# Altium schematic sheet 0243_GPU DECOUPLING_ VD.SchDoc
size 848 x 558 mm
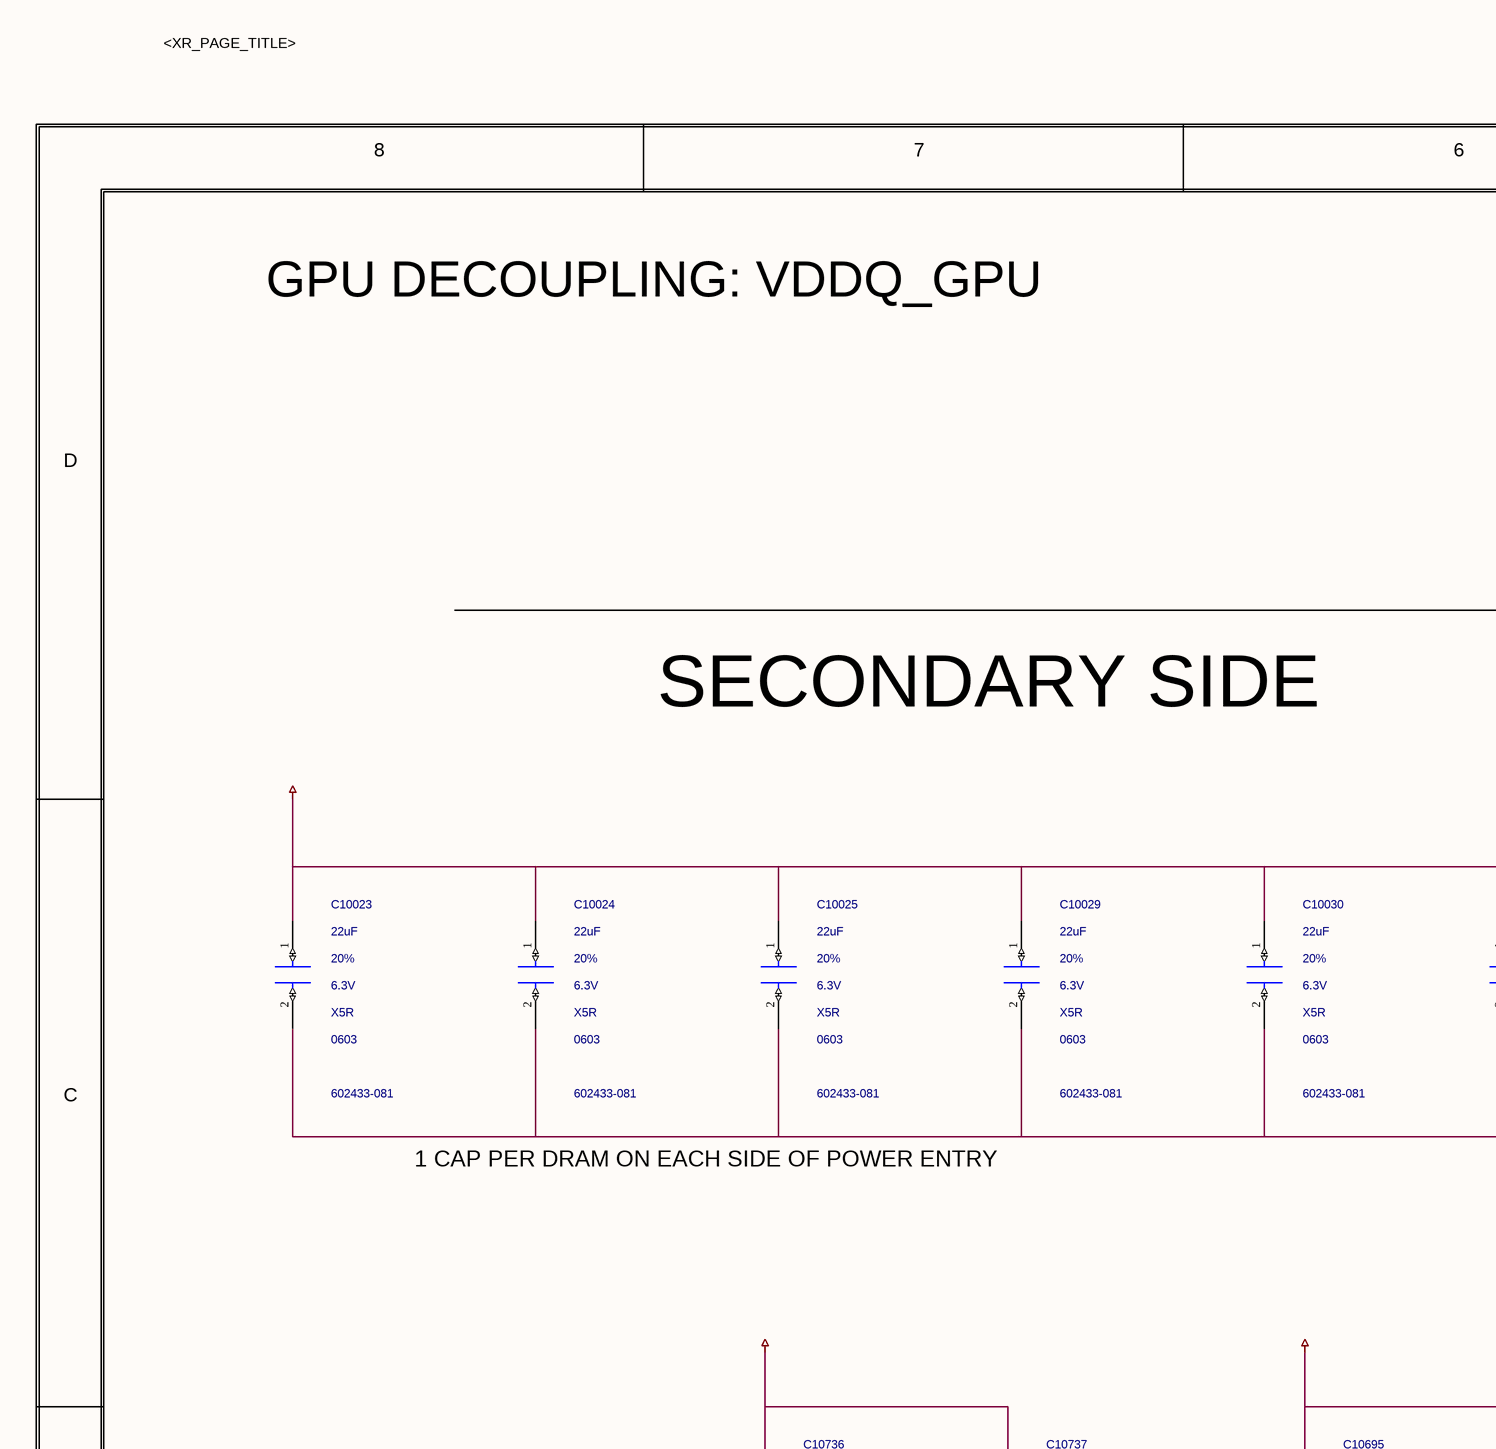
[diagram p0: 0243_GPU DECOUPLING_ VD.SchDoc, top left]
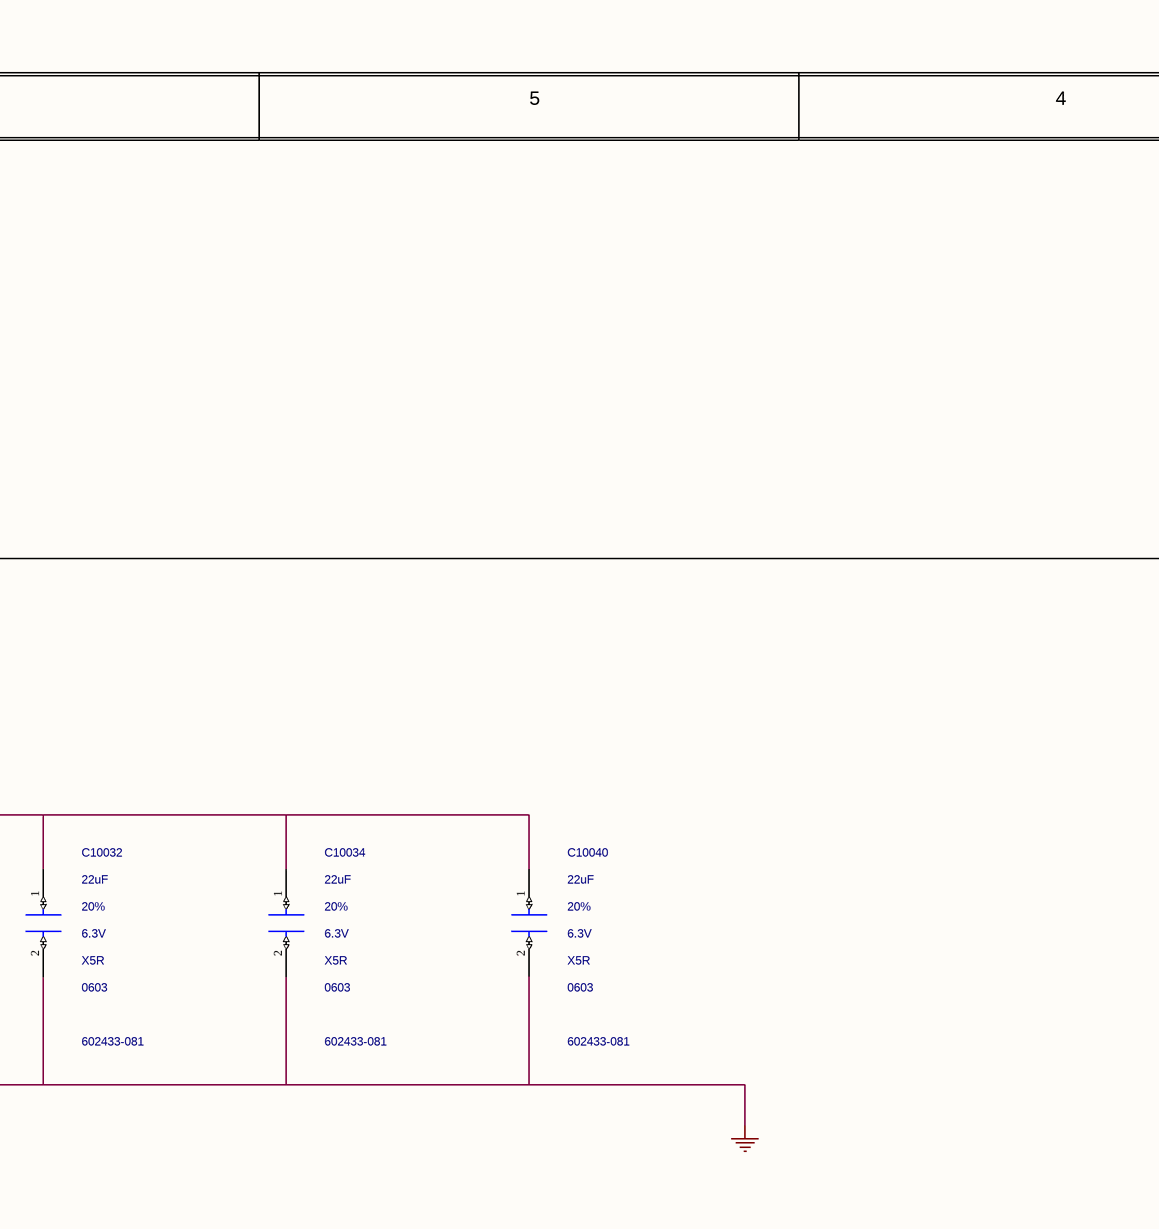
[diagram p1: 0243_GPU DECOUPLING_ VD.SchDoc, top middle]
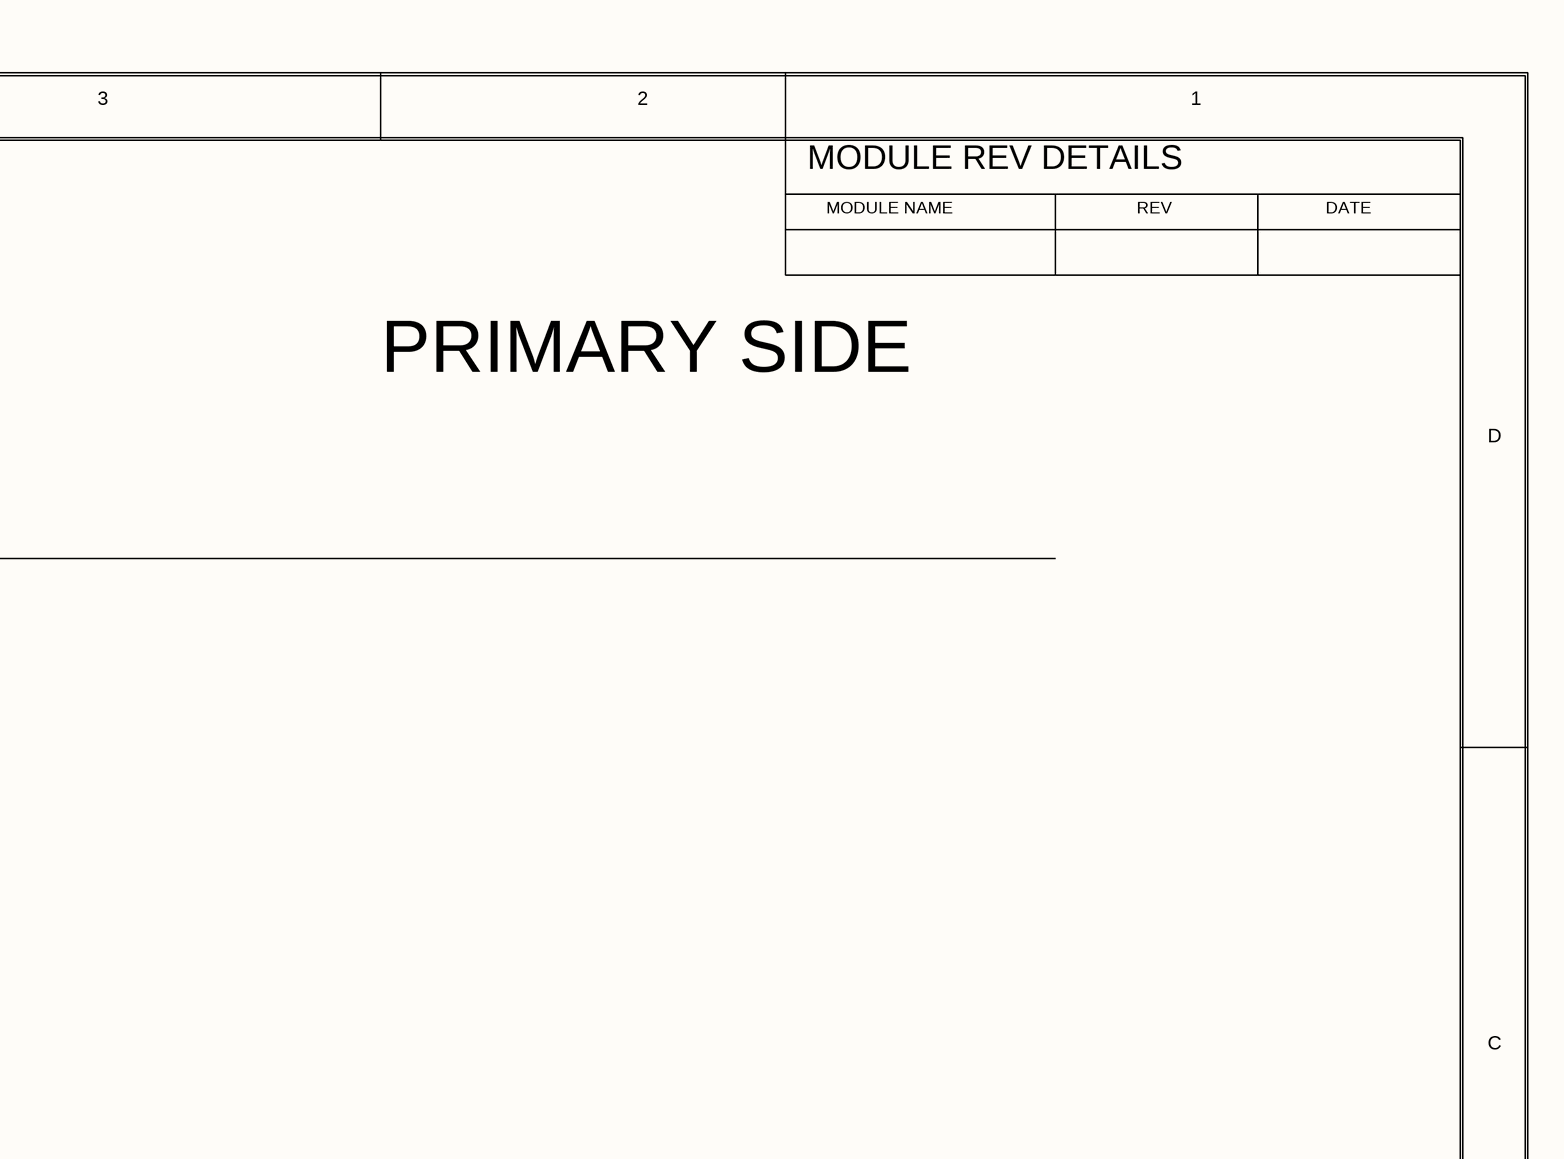
[diagram p2: 0243_GPU DECOUPLING_ VD.SchDoc, top right]
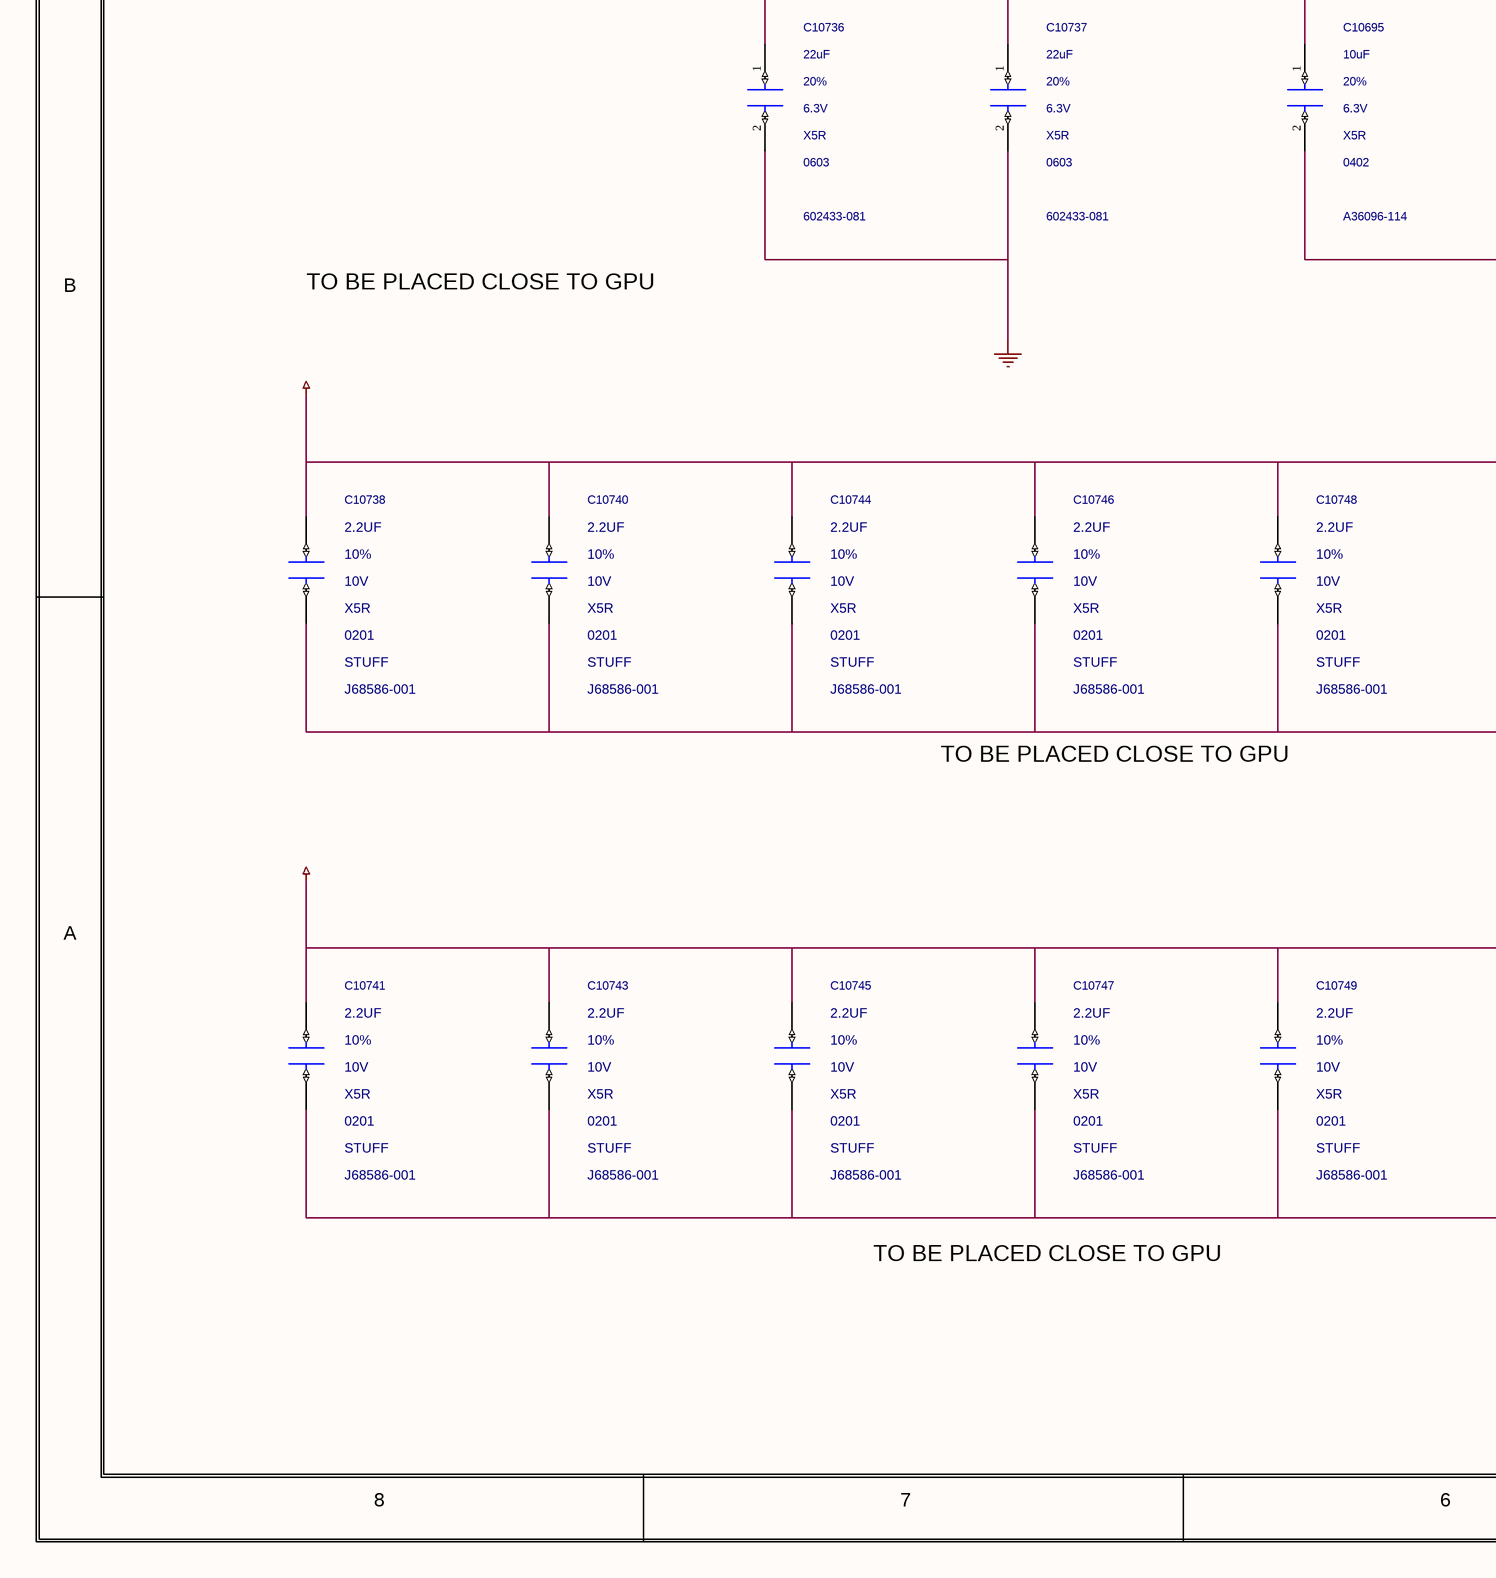
[diagram p3: 0243_GPU DECOUPLING_ VD.SchDoc, bottom left]
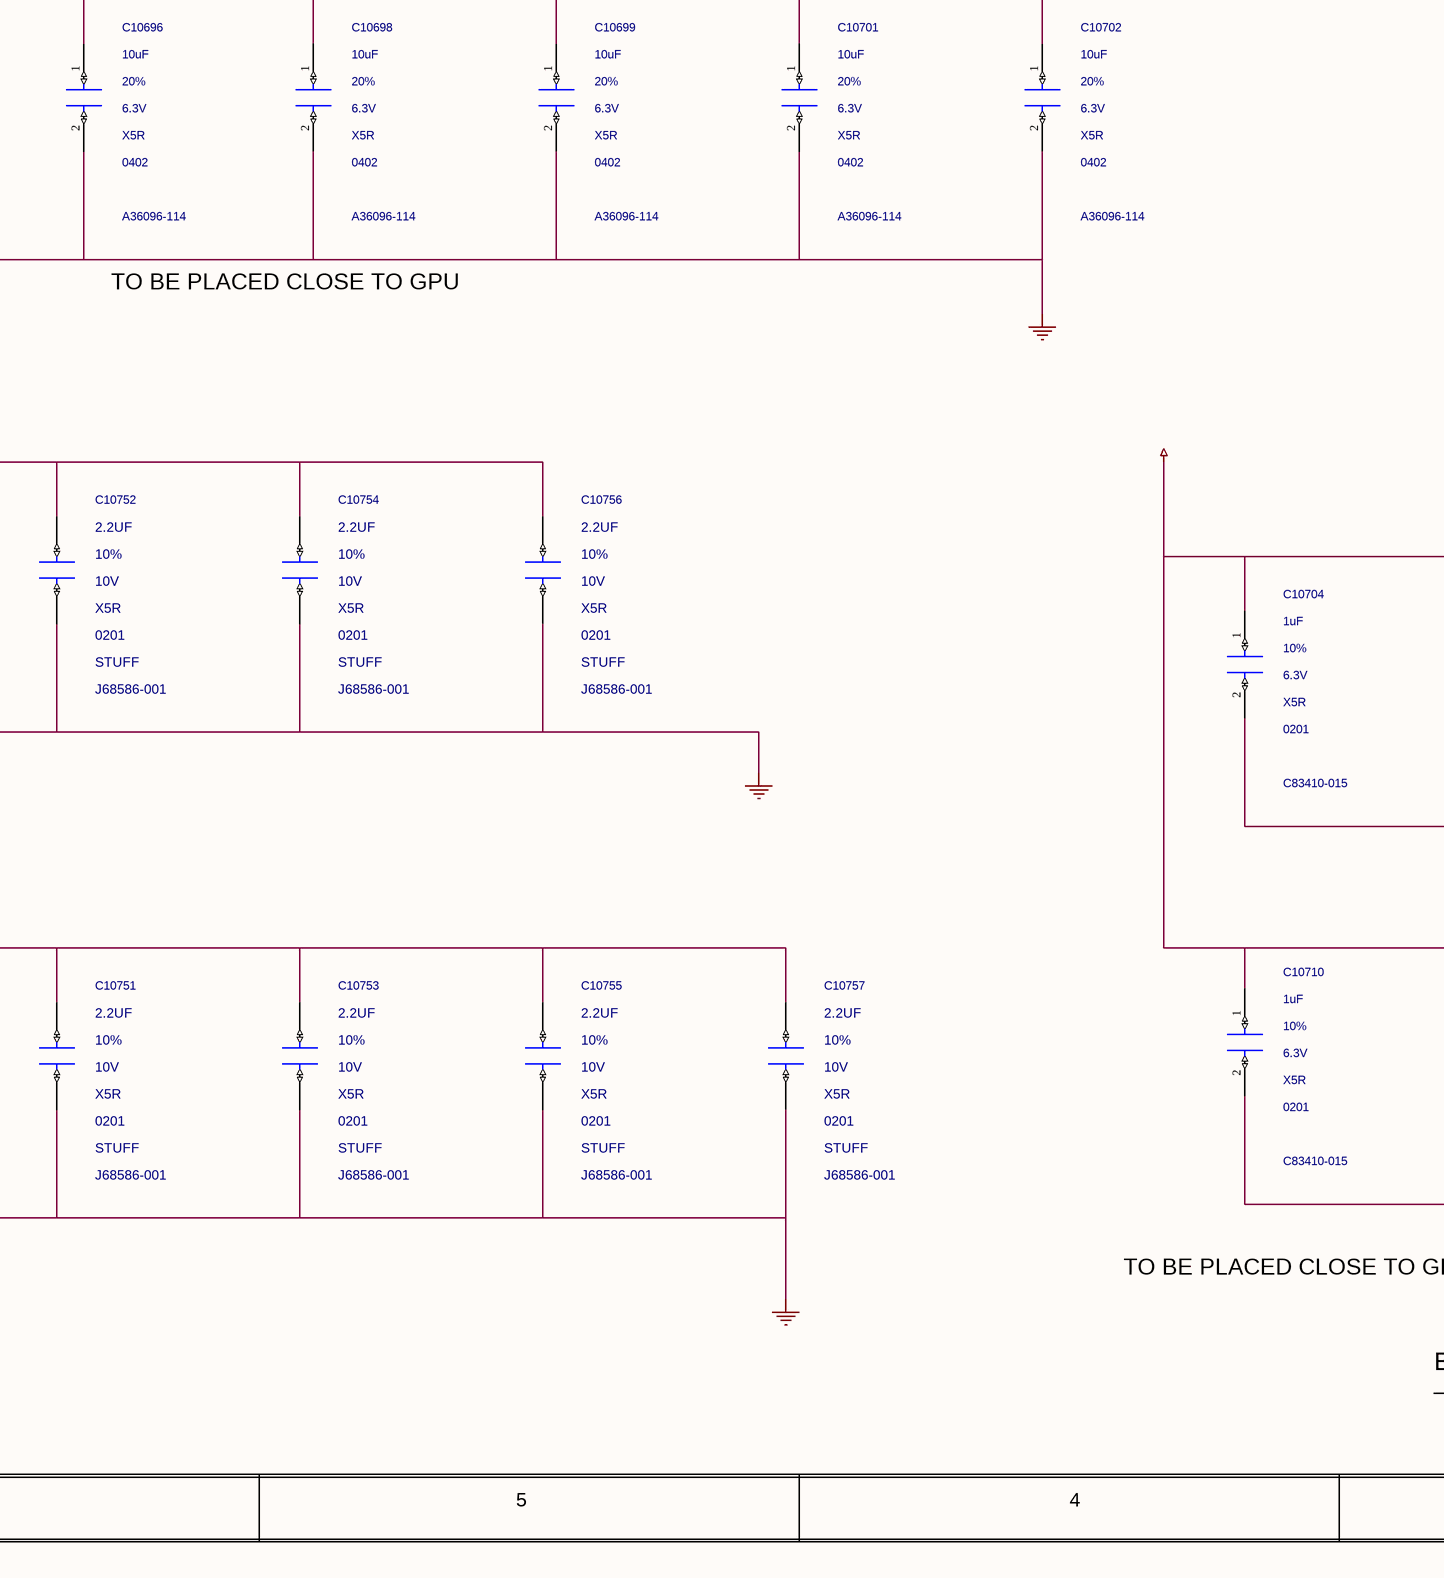
[diagram p4: 0243_GPU DECOUPLING_ VD.SchDoc, bottom middle]
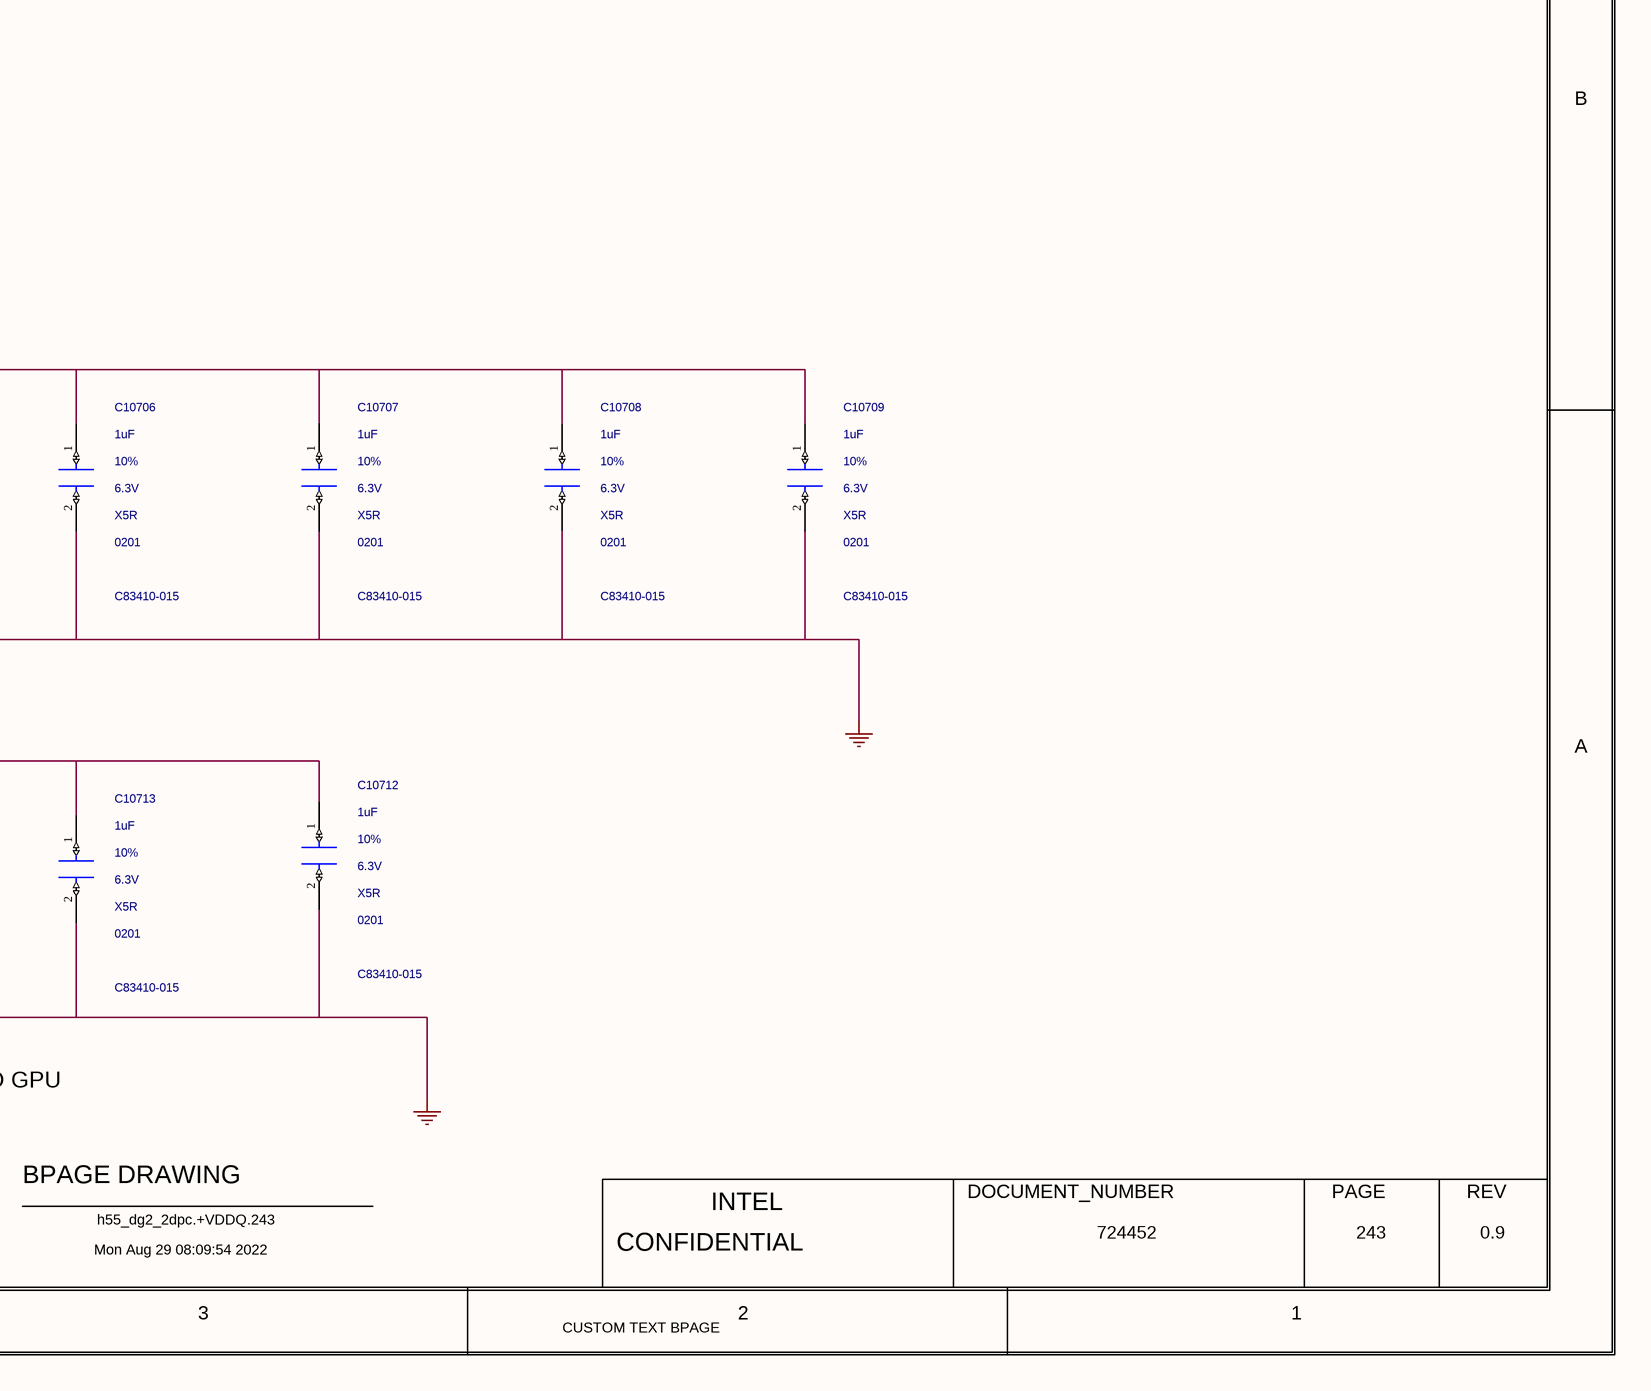
[diagram p5: 0243_GPU DECOUPLING_ VD.SchDoc, bottom right]

## Parts
C10023  22uF  MATERIAL: X5R  PACK_TYPE: 0603  PART_NUMBER: 602433-081  TOLERANCE: 20%  VOLTAGE: 6.3V  [SMC0603ID]
C10024  22uF  MATERIAL: X5R  PACK_TYPE: 0603  PART_NUMBER: 602433-081  TOLERANCE: 20%  VOLTAGE: 6.3V  [SMC0603ID]
C10025  22uF  MATERIAL: X5R  PACK_TYPE: 0603  PART_NUMBER: 602433-081  TOLERANCE: 20%  VOLTAGE: 6.3V  [SMC0603ID]
C10029  22uF  MATERIAL: X5R  PACK_TYPE: 0603  PART_NUMBER: 602433-081  TOLERANCE: 20%  VOLTAGE: 6.3V  [SMC0603ID]
C10030  22uF  MATERIAL: X5R  PACK_TYPE: 0603  PART_NUMBER: 602433-081  TOLERANCE: 20%  VOLTAGE: 6.3V  [SMC0603ID]
C10032  22uF  MATERIAL: X5R  PACK_TYPE: 0603  PART_NUMBER: 602433-081  TOLERANCE: 20%  VOLTAGE: 6.3V  [SMC0603ID]
C10034  22uF  MATERIAL: X5R  PACK_TYPE: 0603  PART_NUMBER: 602433-081  TOLERANCE: 20%  VOLTAGE: 6.3V  [SMC0603ID]
C10040  22uF  MATERIAL: X5R  PACK_TYPE: 0603  PART_NUMBER: 602433-081  TOLERANCE: 20%  VOLTAGE: 6.3V  [SMC0603ID]
C10695  10uF  MATERIAL: X5R  PACK_TYPE: 0402  PART_NUMBER: A36096-114  TOLERANCE: 20%  VOLTAGE: 6.3V  [SMC0402IA]
C10696  10uF  MATERIAL: X5R  PACK_TYPE: 0402  PART_NUMBER: A36096-114  TOLERANCE: 20%  VOLTAGE: 6.3V  [SMC0402IA]
C10698  10uF  MATERIAL: X5R  PACK_TYPE: 0402  PART_NUMBER: A36096-114  TOLERANCE: 20%  VOLTAGE: 6.3V  [SMC0402IA]
C10699  10uF  MATERIAL: X5R  PACK_TYPE: 0402  PART_NUMBER: A36096-114  TOLERANCE: 20%  VOLTAGE: 6.3V  [SMC0402IA]
C10701  10uF  MATERIAL: X5R  PACK_TYPE: 0402  PART_NUMBER: A36096-114  TOLERANCE: 20%  VOLTAGE: 6.3V  [SMC0402IA]
C10702  10uF  MATERIAL: X5R  PACK_TYPE: 0402  PART_NUMBER: A36096-114  TOLERANCE: 20%  VOLTAGE: 6.3V  [SMC0402IA]
C10704  1uF  MATERIAL: X5R  PACK_TYPE: 0201  PART_NUMBER: C83410-015  TOLERANCE: 10%  VOLTAGE: 6.3V  [SMC0201IA]
C10706  1uF  MATERIAL: X5R  PACK_TYPE: 0201  PART_NUMBER: C83410-015  TOLERANCE: 10%  VOLTAGE: 6.3V  [SMC0201IA]
C10707  1uF  MATERIAL: X5R  PACK_TYPE: 0201  PART_NUMBER: C83410-015  TOLERANCE: 10%  VOLTAGE: 6.3V  [SMC0201IA]
C10708  1uF  MATERIAL: X5R  PACK_TYPE: 0201  PART_NUMBER: C83410-015  TOLERANCE: 10%  VOLTAGE: 6.3V  [SMC0201IA]
C10709  1uF  MATERIAL: X5R  PACK_TYPE: 0201  PART_NUMBER: C83410-015  TOLERANCE: 10%  VOLTAGE: 6.3V  [SMC0201IA]
C10710  1uF  MATERIAL: X5R  PACK_TYPE: 0201  PART_NUMBER: C83410-015  TOLERANCE: 10%  VOLTAGE: 6.3V  [SMC0201IA]
C10712  1uF  MATERIAL: X5R  PACK_TYPE: 0201  PART_NUMBER: C83410-015  TOLERANCE: 10%  VOLTAGE: 6.3V  [SMC0201IA]
C10713  1uF  MATERIAL: X5R  PACK_TYPE: 0201  PART_NUMBER: C83410-015  TOLERANCE: 10%  VOLTAGE: 6.3V  [SMC0201IA]
C10736  22uF  MATERIAL: X5R  PACK_TYPE: 0603  PART_NUMBER: 602433-081  TOLERANCE: 20%  VOLTAGE: 6.3V  [SMC0603ID]
C10737  22uF  MATERIAL: X5R  PACK_TYPE: 0603  PART_NUMBER: 602433-081  TOLERANCE: 20%  VOLTAGE: 6.3V  [SMC0603ID]
C10738  2.2UF  BOM_USE: STUFF  MATERIAL: X5R  PACK_TYPE: 0201  PART_NUMBER: J68586-001  TOLERANCE: 10%  VOLTAGE: 10V  [TK0_SM0201_690X390_MC]
C10740  2.2UF  BOM_USE: STUFF  MATERIAL: X5R  PACK_TYPE: 0201  PART_NUMBER: J68586-001  TOLERANCE: 10%  VOLTAGE: 10V  [TK0_SM0201_690X390_MC]
C10741  2.2UF  BOM_USE: STUFF  MATERIAL: X5R  PACK_TYPE: 0201  PART_NUMBER: J68586-001  TOLERANCE: 10%  VOLTAGE: 10V  [TK0_SM0201_690X390_MC]
C10743  2.2UF  BOM_USE: STUFF  MATERIAL: X5R  PACK_TYPE: 0201  PART_NUMBER: J68586-001  TOLERANCE: 10%  VOLTAGE: 10V  [TK0_SM0201_690X390_MC]
C10744  2.2UF  BOM_USE: STUFF  MATERIAL: X5R  PACK_TYPE: 0201  PART_NUMBER: J68586-001  TOLERANCE: 10%  VOLTAGE: 10V  [TK0_SM0201_690X390_MC]
C10745  2.2UF  BOM_USE: STUFF  MATERIAL: X5R  PACK_TYPE: 0201  PART_NUMBER: J68586-001  TOLERANCE: 10%  VOLTAGE: 10V  [TK0_SM0201_690X390_MC]
C10746  2.2UF  BOM_USE: STUFF  MATERIAL: X5R  PACK_TYPE: 0201  PART_NUMBER: J68586-001  TOLERANCE: 10%  VOLTAGE: 10V  [TK0_SM0201_690X390_MC]
C10747  2.2UF  BOM_USE: STUFF  MATERIAL: X5R  PACK_TYPE: 0201  PART_NUMBER: J68586-001  TOLERANCE: 10%  VOLTAGE: 10V  [TK0_SM0201_690X390_MC]
C10748  2.2UF  BOM_USE: STUFF  MATERIAL: X5R  PACK_TYPE: 0201  PART_NUMBER: J68586-001  TOLERANCE: 10%  VOLTAGE: 10V  [TK0_SM0201_690X390_MC]
C10749  2.2UF  BOM_USE: STUFF  MATERIAL: X5R  PACK_TYPE: 0201  PART_NUMBER: J68586-001  TOLERANCE: 10%  VOLTAGE: 10V  [TK0_SM0201_690X390_MC]
C10751  2.2UF  BOM_USE: STUFF  MATERIAL: X5R  PACK_TYPE: 0201  PART_NUMBER: J68586-001  TOLERANCE: 10%  VOLTAGE: 10V  [TK0_SM0201_690X390_MC]
C10752  2.2UF  BOM_USE: STUFF  MATERIAL: X5R  PACK_TYPE: 0201  PART_NUMBER: J68586-001  TOLERANCE: 10%  VOLTAGE: 10V  [TK0_SM0201_690X390_MC]
C10753  2.2UF  BOM_USE: STUFF  MATERIAL: X5R  PACK_TYPE: 0201  PART_NUMBER: J68586-001  TOLERANCE: 10%  VOLTAGE: 10V  [TK0_SM0201_690X390_MC]
C10754  2.2UF  BOM_USE: STUFF  MATERIAL: X5R  PACK_TYPE: 0201  PART_NUMBER: J68586-001  TOLERANCE: 10%  VOLTAGE: 10V  [TK0_SM0201_690X390_MC]
C10755  2.2UF  BOM_USE: STUFF  MATERIAL: X5R  PACK_TYPE: 0201  PART_NUMBER: J68586-001  TOLERANCE: 10%  VOLTAGE: 10V  [TK0_SM0201_690X390_MC]
C10756  2.2UF  BOM_USE: STUFF  MATERIAL: X5R  PACK_TYPE: 0201  PART_NUMBER: J68586-001  TOLERANCE: 10%  VOLTAGE: 10V  [TK0_SM0201_690X390_MC]
C10757  2.2UF  BOM_USE: STUFF  MATERIAL: X5R  PACK_TYPE: 0201  PART_NUMBER: J68586-001  TOLERANCE: 10%  VOLTAGE: 10V  [TK0_SM0201_690X390_MC]

## Nets
+VDDQ_GPU: C10023.1(A) C10024.1(A) C10025.1(A) C10029.1(A) C10030.1(A) C10032.1(A) C10034.1(A) C10040.1(A) C10695.1(A) C10696.1(A) C10698.1(A) C10699.1(A) C10701.1(A) C10702.1(A) C10704.1(A) C10706.1(A) C10707.1(A) C10708.1(A) C10709.1(A) C10710.1(A) C10712.1(A) C10713.1(A) C10736.1(A) C10737.1(A) C10738.1(A) C10740.1(A) C10741.1(A) C10743.1(A) C10744.1(A) C10745.1(A) C10746.1(A) C10747.1(A) C10748.1(A) C10749.1(A) C10751.1(A) C10752.1(A) C10753.1(A) C10754.1(A) C10755.1(A) C10756.1(A) C10757.1(A)
GND: C10023.2(B) C10024.2(B) C10025.2(B) C10029.2(B) C10030.2(B) C10032.2(B) C10034.2(B) C10040.2(B) C10695.2(B) C10696.2(B) C10698.2(B) C10699.2(B) C10701.2(B) C10702.2(B) C10704.2(B) C10706.2(B) C10707.2(B) C10708.2(B) C10709.2(B) C10710.2(B) C10712.2(B) C10713.2(B) C10736.2(B) C10737.2(B) C10738.2(B) C10740.2(B) C10741.2(B) C10743.2(B) C10744.2(B) C10745.2(B) C10746.2(B) C10747.2(B) C10748.2(B) C10749.2(B) C10751.2(B) C10752.2(B) C10753.2(B) C10754.2(B) C10755.2(B) C10756.2(B) C10757.2(B)

## Notes on the sheet
- <XR_PAGE_TITLE>
- 8
- 7
- 6
- 5
- 4
- 3
- 2
- 1
- MODULE REV DETAILS
- GPU DECOUPLING: VDDQ_GPU
- MODULE NAME
- REV
- DATE
- PRIMARY SIDE
- D
- SECONDARY SIDE
- C
- 1 CAP PER DRAM ON EACH SIDE OF POWER ENTRY
- B
- TO BE PLACED CLOSE TO GPU
- A
- BPAGE DRAWING
- INTEL
- DOCUMENT_NUMBER
- PAGE
- Mon Aug 29 08:09:54 2022
- h55_dg2_2dpc.+VDDQ.243
- CONFIDENTIAL
- 724452
- 243
- 0.9
- CUSTOM TEXT BPAGE

## Library data of the parts
C10023 = CAP: CDS_PHYS_PART_NAME: CAP_0603-602433-081,X5R,22UF,6.3V,20%,LPDB,GENERIC; OriginalSymbolOrigin: (-50,25); XY: (-2425,2475); VER: 1; ROT: 0; PHYS_PAGE: 243; LOCATION: C10023; DRAWING: @RVP1_ADL_SB_ADP_S_DDR5_SODIMM_2DPC_LIB.H55_DG2_2DPC(SCH_1):PAGE414; CDS_LIB: discrete; PCB Footprint: SMC0603ID; CHIPS_PART_NAME: CAP; CDS_PART_NAME: CAP_0603-602433-081,X5R,22UF,6.3V,20%,LPDB,GENERIC; CDS_LOCATION: C10023
C10024 = CAP: CDS_PHYS_PART_NAME: CAP_0603-602433-081,X5R,22UF,6.3V,20%,LPDB,GENERIC; OriginalSymbolOrigin: (-50,25); XY: (-1975,2475); VER: 1; ROT: 0; PHYS_PAGE: 243; LOCATION: C10024; DRAWING: @RVP1_ADL_SB_ADP_S_DDR5_SODIMM_2DPC_LIB.H55_DG2_2DPC(SCH_1):PAGE414; CDS_LIB: discrete; PCB Footprint: SMC0603ID; CHIPS_PART_NAME: CAP; CDS_PART_NAME: CAP_0603-602433-081,X5R,22UF,6.3V,20%,LPDB,GENERIC; CDS_LOCATION: C10024
C10025 = CAP: CDS_PHYS_PART_NAME: CAP_0603-602433-081,X5R,22UF,6.3V,20%,LPDB,GENERIC; OriginalSymbolOrigin: (-50,25); XY: (-1525,2475); VER: 1; ROT: 0; PHYS_PAGE: 243; LOCATION: C10025; DRAWING: @RVP1_ADL_SB_ADP_S_DDR5_SODIMM_2DPC_LIB.H55_DG2_2DPC(SCH_1):PAGE414; CDS_LIB: discrete; PCB Footprint: SMC0603ID; CHIPS_PART_NAME: CAP; CDS_PART_NAME: CAP_0603-602433-081,X5R,22UF,6.3V,20%,LPDB,GENERIC; CDS_LOCATION: C10025
C10029 = CAP: CDS_PHYS_PART_NAME: CAP_0603-602433-081,X5R,22UF,6.3V,20%,LPDB,GENERIC; OriginalSymbolOrigin: (-50,25); XY: (-1075,2475); VER: 1; ROT: 0; PHYS_PAGE: 243; LOCATION: C10029; DRAWING: @RVP1_ADL_SB_ADP_S_DDR5_SODIMM_2DPC_LIB.H55_DG2_2DPC(SCH_1):PAGE414; CDS_LIB: discrete; PCB Footprint: SMC0603ID; CHIPS_PART_NAME: CAP; CDS_PART_NAME: CAP_0603-602433-081,X5R,22UF,6.3V,20%,LPDB,GENERIC; CDS_LOCATION: C10029
C10030 = CAP: CDS_PHYS_PART_NAME: CAP_0603-602433-081,X5R,22UF,6.3V,20%,LPDB,GENERIC; OriginalSymbolOrigin: (-50,25); XY: (-625,2475); VER: 1; ROT: 0; PHYS_PAGE: 243; LOCATION: C10030; DRAWING: @RVP1_ADL_SB_ADP_S_DDR5_SODIMM_2DPC_LIB.H55_DG2_2DPC(SCH_1):PAGE414; CDS_LIB: discrete; PCB Footprint: SMC0603ID; CHIPS_PART_NAME: CAP; CDS_PART_NAME: CAP_0603-602433-081,X5R,22UF,6.3V,20%,LPDB,GENERIC; CDS_LOCATION: C10030
C10032 = CAP: CDS_PHYS_PART_NAME: CAP_0603-602433-081,X5R,22UF,6.3V,20%,LPDB,GENERIC; OriginalSymbolOrigin: (-50,25); XY: (-175,2475); VER: 1; ROT: 0; PHYS_PAGE: 243; LOCATION: C10032; DRAWING: @RVP1_ADL_SB_ADP_S_DDR5_SODIMM_2DPC_LIB.H55_DG2_2DPC(SCH_1):PAGE414; CDS_LIB: discrete; PCB Footprint: SMC0603ID; CHIPS_PART_NAME: CAP; CDS_PART_NAME: CAP_0603-602433-081,X5R,22UF,6.3V,20%,LPDB,GENERIC; CDS_LOCATION: C10032
C10034 = CAP: CDS_PHYS_PART_NAME: CAP_0603-602433-081,X5R,22UF,6.3V,20%,LPDB,GENERIC; OriginalSymbolOrigin: (-50,25); XY: (275,2475); VER: 1; ROT: 0; PHYS_PAGE: 243; LOCATION: C10034; DRAWING: @RVP1_ADL_SB_ADP_S_DDR5_SODIMM_2DPC_LIB.H55_DG2_2DPC(SCH_1):PAGE414; CDS_LIB: discrete; PCB Footprint: SMC0603ID; CHIPS_PART_NAME: CAP; CDS_PART_NAME: CAP_0603-602433-081,X5R,22UF,6.3V,20%,LPDB,GENERIC; CDS_LOCATION: C10034
C10040 = CAP: CDS_PHYS_PART_NAME: CAP_0603-602433-081,X5R,22UF,6.3V,20%,LPDB,GENERIC; OriginalSymbolOrigin: (-50,25); XY: (725,2475); VER: 1; ROT: 0; PHYS_PAGE: 243; LOCATION: C10040; DRAWING: @RVP1_ADL_SB_ADP_S_DDR5_SODIMM_2DPC_LIB.H55_DG2_2DPC(SCH_1):PAGE414; CDS_LIB: discrete; PCB Footprint: SMC0603ID; CHIPS_PART_NAME: CAP; CDS_PART_NAME: CAP_0603-602433-081,X5R,22UF,6.3V,20%,LPDB,GENERIC; CDS_LOCATION: C10040
C10695 = CAP: CDS_PHYS_PART_NAME: CAP_0402-A36096-114,X5R,10UF,6.3V,20%,LPDB,GENERIC; OriginalSymbolOrigin: (-50,25); XY: (-550,1475); VER: 1; ROT: 0; PHYS_PAGE: 243; LOCATION: C10695; DRAWING: @RVP1_ADL_SB_ADP_S_DDR5_SODIMM_2DPC_LIB.H55_DG2_2DPC(SCH_1):PAGE414; CDS_LIB: discrete; PCB Footprint: SMC0402IA; CHIPS_PART_NAME: CAP; CDS_PART_NAME: CAP_0402-A36096-114,X5R,10UF,6.3V,20%,LPDB,GENERIC; CDS_LOCATION: C10695
C10696 = CAP: CDS_PHYS_PART_NAME: CAP_0402-A36096-114,X5R,10UF,6.3V,20%,LPDB,GENERIC; OriginalSymbolOrigin: (-50,25); XY: (-100,1475); VER: 1; ROT: 0; PHYS_PAGE: 243; LOCATION: C10696; DRAWING: @RVP1_ADL_SB_ADP_S_DDR5_SODIMM_2DPC_LIB.H55_DG2_2DPC(SCH_1):PAGE414; CDS_LIB: discrete; PCB Footprint: SMC0402IA; CHIPS_PART_NAME: CAP; CDS_PART_NAME: CAP_0402-A36096-114,X5R,10UF,6.3V,20%,LPDB,GENERIC; CDS_LOCATION: C10696
C10698 = CAP: CDS_PHYS_PART_NAME: CAP_0402-A36096-114,X5R,10UF,6.3V,20%,LPDB,GENERIC; OriginalSymbolOrigin: (-50,25); XY: (325,1475); VER: 1; ROT: 0; PHYS_PAGE: 243; LOCATION: C10698; DRAWING: @RVP1_ADL_SB_ADP_S_DDR5_SODIMM_2DPC_LIB.H55_DG2_2DPC(SCH_1):PAGE414; CDS_LIB: discrete; PCB Footprint: SMC0402IA; CHIPS_PART_NAME: CAP; CDS_PART_NAME: CAP_0402-A36096-114,X5R,10UF,6.3V,20%,LPDB,GENERIC; CDS_LOCATION: C10698
C10699 = CAP: CDS_PHYS_PART_NAME: CAP_0402-A36096-114,X5R,10UF,6.3V,20%,LPDB,GENERIC; OriginalSymbolOrigin: (-50,25); XY: (775,1475); VER: 1; ROT: 0; PHYS_PAGE: 243; LOCATION: C10699; DRAWING: @RVP1_ADL_SB_ADP_S_DDR5_SODIMM_2DPC_LIB.H55_DG2_2DPC(SCH_1):PAGE414; CDS_LIB: discrete; PCB Footprint: SMC0402IA; CHIPS_PART_NAME: CAP; CDS_PART_NAME: CAP_0402-A36096-114,X5R,10UF,6.3V,20%,LPDB,GENERIC; CDS_LOCATION: C10699
C10701 = CAP: CDS_PHYS_PART_NAME: CAP_0402-A36096-114,X5R,10UF,6.3V,20%,LPDB,GENERIC; OriginalSymbolOrigin: (-50,25); XY: (1225,1475); VER: 1; ROT: 0; PHYS_PAGE: 243; LOCATION: C10701; DRAWING: @RVP1_ADL_SB_ADP_S_DDR5_SODIMM_2DPC_LIB.H55_DG2_2DPC(SCH_1):PAGE414; CDS_LIB: discrete; PCB Footprint: SMC0402IA; CHIPS_PART_NAME: CAP; CDS_PART_NAME: CAP_0402-A36096-114,X5R,10UF,6.3V,20%,LPDB,GENERIC; CDS_LOCATION: C10701
C10702 = CAP: CDS_PHYS_PART_NAME: CAP_0402-A36096-114,X5R,10UF,6.3V,20%,LPDB,GENERIC; OriginalSymbolOrigin: (-50,25); XY: (1675,1475); VER: 1; ROT: 0; PHYS_PAGE: 243; LOCATION: C10702; DRAWING: @RVP1_ADL_SB_ADP_S_DDR5_SODIMM_2DPC_LIB.H55_DG2_2DPC(SCH_1):PAGE414; CDS_LIB: discrete; PCB Footprint: SMC0402IA; CHIPS_PART_NAME: CAP; CDS_PART_NAME: CAP_0402-A36096-114,X5R,10UF,6.3V,20%,LPDB,GENERIC; CDS_LOCATION: C10702
C10704 = CAP: CDS_PHYS_PART_NAME: CAP_0201-C83410-015,X5R,1UF,6.3V,10%,LPDB,GENERIC; OriginalSymbolOrigin: (-50,25); XY: (2050,425); VER: 1; ROT: 0; PHYS_PAGE: 243; LOCATION: C10704; DRAWING: @RVP1_ADL_SB_ADP_S_DDR5_SODIMM_2DPC_LIB.H55_DG2_2DPC(SCH_1):PAGE414; CDS_LIB: discrete; PCB Footprint: SMC0201IA; CHIPS_PART_NAME: CAP; CDS_PART_NAME: CAP_0201-C83410-015,X5R,1UF,6.3V,10%,LPDB,GENERIC; CDS_LOCATION: C10704
C10706 = CAP: CDS_PHYS_PART_NAME: CAP_0201-C83410-015,X5R,1UF,6.3V,10%,LPDB,GENERIC; OriginalSymbolOrigin: (-50,25); XY: (2500,425); VER: 1; ROT: 0; PHYS_PAGE: 243; LOCATION: C10706; DRAWING: @RVP1_ADL_SB_ADP_S_DDR5_SODIMM_2DPC_LIB.H55_DG2_2DPC(SCH_1):PAGE414; CDS_LIB: discrete; PCB Footprint: SMC0201IA; CHIPS_PART_NAME: CAP; CDS_PART_NAME: CAP_0201-C83410-015,X5R,1UF,6.3V,10%,LPDB,GENERIC; CDS_LOCATION: C10706
C10707 = CAP: CDS_PHYS_PART_NAME: CAP_0201-C83410-015,X5R,1UF,6.3V,10%,LPDB,GENERIC; OriginalSymbolOrigin: (-50,25); XY: (2950,425); VER: 1; ROT: 0; PHYS_PAGE: 243; LOCATION: C10707; DRAWING: @RVP1_ADL_SB_ADP_S_DDR5_SODIMM_2DPC_LIB.H55_DG2_2DPC(SCH_1):PAGE414; CDS_LIB: discrete; PCB Footprint: SMC0201IA; CHIPS_PART_NAME: CAP; CDS_PART_NAME: CAP_0201-C83410-015,X5R,1UF,6.3V,10%,LPDB,GENERIC; CDS_LOCATION: C10707
C10708 = CAP: CDS_PHYS_PART_NAME: CAP_0201-C83410-015,X5R,1UF,6.3V,10%,LPDB,GENERIC; OriginalSymbolOrigin: (-50,25); XY: (3400,425); VER: 1; ROT: 0; PHYS_PAGE: 243; LOCATION: C10708; DRAWING: @RVP1_ADL_SB_ADP_S_DDR5_SODIMM_2DPC_LIB.H55_DG2_2DPC(SCH_1):PAGE414; CDS_LIB: discrete; PCB Footprint: SMC0201IA; CHIPS_PART_NAME: CAP; CDS_PART_NAME: CAP_0201-C83410-015,X5R,1UF,6.3V,10%,LPDB,GENERIC; CDS_LOCATION: C10708
C10709 = CAP: CDS_PHYS_PART_NAME: CAP_0201-C83410-015,X5R,1UF,6.3V,10%,LPDB,GENERIC; OriginalSymbolOrigin: (-50,25); XY: (3850,425); VER: 1; ROT: 0; PHYS_PAGE: 243; LOCATION: C10709; DRAWING: @RVP1_ADL_SB_ADP_S_DDR5_SODIMM_2DPC_LIB.H55_DG2_2DPC(SCH_1):PAGE414; CDS_LIB: discrete; PCB Footprint: SMC0201IA; CHIPS_PART_NAME: CAP; CDS_PART_NAME: CAP_0201-C83410-015,X5R,1UF,6.3V,10%,LPDB,GENERIC; CDS_LOCATION: C10709
C10710 = CAP: CDS_PHYS_PART_NAME: CAP_0201-C83410-015,X5R,1UF,6.3V,10%,LPDB,GENERIC; OriginalSymbolOrigin: (-50,25); XY: (2050,-275); VER: 1; ROT: 0; PHYS_PAGE: 243; LOCATION: C10710; DRAWING: @RVP1_ADL_SB_ADP_S_DDR5_SODIMM_2DPC_LIB.H55_DG2_2DPC(SCH_1):PAGE414; CDS_LIB: discrete; PCB Footprint: SMC0201IA; CHIPS_PART_NAME: CAP; CDS_PART_NAME: CAP_0201-C83410-015,X5R,1UF,6.3V,10%,LPDB,GENERIC; CDS_LOCATION: C10710
C10712 = CAP: CDS_PHYS_PART_NAME: CAP_0201-C83410-015,X5R,1UF,6.3V,10%,LPDB,GENERIC; OriginalSymbolOrigin: (-50,25); XY: (2950,-275); VER: 1; ROT: 0; PHYS_PAGE: 243; LOCATION: C10712; DRAWING: @RVP1_ADL_SB_ADP_S_DDR5_SODIMM_2DPC_LIB.H55_DG2_2DPC(SCH_1):PAGE414; CDS_LIB: discrete; PCB Footprint: SMC0201IA; CHIPS_PART_NAME: CAP; CDS_PART_NAME: CAP_0201-C83410-015,X5R,1UF,6.3V,10%,LPDB,GENERIC; CDS_LOCATION: C10712
C10713 = CAP: CDS_PHYS_PART_NAME: CAP_0201-C83410-015,X5R,1UF,6.3V,10%,LPDB,GENERIC; OriginalSymbolOrigin: (-50,25); XY: (2500,-300); VER: 1; ROT: 0; PHYS_PAGE: 243; LOCATION: C10713; DRAWING: @RVP1_ADL_SB_ADP_S_DDR5_SODIMM_2DPC_LIB.H55_DG2_2DPC(SCH_1):PAGE414; CDS_LIB: discrete; PCB Footprint: SMC0201IA; CHIPS_PART_NAME: CAP; CDS_PART_NAME: CAP_0201-C83410-015,X5R,1UF,6.3V,10%,LPDB,GENERIC; CDS_LOCATION: C10713
C10736 = CAP: CDS_PHYS_PART_NAME: CAP_0603-602433-081,X5R,22UF,6.3V,20%,LPDB,GENERIC; OriginalSymbolOrigin: (-50,25); XY: (-1550,1475); VER: 1; ROT: 0; PHYS_PAGE: 243; LOCATION: C10736; DRAWING: @RVP1_ADL_SB_ADP_S_DDR5_SODIMM_2DPC_LIB.H55_DG2_2DPC(SCH_1):PAGE414; CDS_LIB: discrete; PCB Footprint: SMC0603ID; CHIPS_PART_NAME: CAP; CDS_PART_NAME: CAP_0603-602433-081,X5R,22UF,6.3V,20%,LPDB,GENERIC; CDS_LOCATION: C10736
C10737 = CAP: CDS_PHYS_PART_NAME: CAP_0603-602433-081,X5R,22UF,6.3V,20%,LPDB,GENERIC; OriginalSymbolOrigin: (-50,25); XY: (-1100,1475); VER: 1; ROT: 0; PHYS_PAGE: 243; LOCATION: C10737; DRAWING: @RVP1_ADL_SB_ADP_S_DDR5_SODIMM_2DPC_LIB.H55_DG2_2DPC(SCH_1):PAGE414; CDS_LIB: discrete; PCB Footprint: SMC0603ID; CHIPS_PART_NAME: CAP; CDS_PART_NAME: CAP_0603-602433-081,X5R,22UF,6.3V,20%,LPDB,GENERIC; CDS_LOCATION: C10737
C10738 = CAP_2: CDS_PHYS_PART_NAME: CAP_2_0201-J68586-001,X5R,2.2UF,10V,10%,TK0,GENERIC; CDS_LMAN_SYM_OUTLINE: -50,50,50,-50; FP_TECH: TK0; IP: GENERIC; ROOM: NONE; OriginalSymbolOrigin: (-50,25); XY: (-2400,600); VER: 1; ROT: 0; PHYS_PAGE: 243; LOCATION: C10738; DRAWING: @RVP1_ADL_SB_ADP_S_DDR5_SODIMM_2DPC_LIB.H55_DG2_2DPC(SCH_1):PAGE414; CDS_LIB: discrete_2; VARIANT: ?; PCB Footprint: TK0_SM0201_690X390_MC; CHIPS_PART_NAME: CAP_2; CDS_PART_NAME: CAP_2_0201-J68586-001,X5R,2.2UF,10V,10%,TK0,GENERIC; CDS_LOCATION: C10738
C10740 = CAP_2: CDS_PHYS_PART_NAME: CAP_2_0201-J68586-001,X5R,2.2UF,10V,10%,TK0,GENERIC; CDS_LMAN_SYM_OUTLINE: -50,50,50,-50; FP_TECH: TK0; IP: GENERIC; ROOM: NONE; OriginalSymbolOrigin: (-50,25); XY: (-1950,600); VER: 1; ROT: 0; PHYS_PAGE: 243; LOCATION: C10740; DRAWING: @RVP1_ADL_SB_ADP_S_DDR5_SODIMM_2DPC_LIB.H55_DG2_2DPC(SCH_1):PAGE414; CDS_LIB: discrete_2; VARIANT: ?; PCB Footprint: TK0_SM0201_690X390_MC; CHIPS_PART_NAME: CAP_2; CDS_PART_NAME: CAP_2_0201-J68586-001,X5R,2.2UF,10V,10%,TK0,GENERIC; CDS_LOCATION: C10740
C10741 = CAP_2: CDS_PHYS_PART_NAME: CAP_2_0201-J68586-001,X5R,2.2UF,10V,10%,TK0,GENERIC; CDS_LMAN_SYM_OUTLINE: -50,50,50,-50; FP_TECH: TK0; IP: GENERIC; ROOM: NONE; OriginalSymbolOrigin: (-50,25); XY: (-2400,-300); VER: 1; ROT: 0; PHYS_PAGE: 243; LOCATION: C10741; DRAWING: @RVP1_ADL_SB_ADP_S_DDR5_SODIMM_2DPC_LIB.H55_DG2_2DPC(SCH_1):PAGE414; CDS_LIB: discrete_2; VARIANT: ?; PCB Footprint: TK0_SM0201_690X390_MC; CHIPS_PART_NAME: CAP_2; CDS_PART_NAME: CAP_2_0201-J68586-001,X5R,2.2UF,10V,10%,TK0,GENERIC; CDS_LOCATION: C10741
C10743 = CAP_2: CDS_PHYS_PART_NAME: CAP_2_0201-J68586-001,X5R,2.2UF,10V,10%,TK0,GENERIC; CDS_LMAN_SYM_OUTLINE: -50,50,50,-50; FP_TECH: TK0; IP: GENERIC; ROOM: NONE; OriginalSymbolOrigin: (-50,25); XY: (-1950,-300); VER: 1; ROT: 0; PHYS_PAGE: 243; LOCATION: C10743; DRAWING: @RVP1_ADL_SB_ADP_S_DDR5_SODIMM_2DPC_LIB.H55_DG2_2DPC(SCH_1):PAGE414; CDS_LIB: discrete_2; VARIANT: ?; PCB Footprint: TK0_SM0201_690X390_MC; CHIPS_PART_NAME: CAP_2; CDS_PART_NAME: CAP_2_0201-J68586-001,X5R,2.2UF,10V,10%,TK0,GENERIC; CDS_LOCATION: C10743
C10744 = CAP_2: CDS_PHYS_PART_NAME: CAP_2_0201-J68586-001,X5R,2.2UF,10V,10%,TK0,GENERIC; CDS_LMAN_SYM_OUTLINE: -50,50,50,-50; FP_TECH: TK0; IP: GENERIC; ROOM: NONE; OriginalSymbolOrigin: (-50,25); XY: (-1500,600); VER: 1; ROT: 0; PHYS_PAGE: 243; LOCATION: C10744; DRAWING: @RVP1_ADL_SB_ADP_S_DDR5_SODIMM_2DPC_LIB.H55_DG2_2DPC(SCH_1):PAGE414; CDS_LIB: discrete_2; VARIANT: ?; PCB Footprint: TK0_SM0201_690X390_MC; CHIPS_PART_NAME: CAP_2; CDS_PART_NAME: CAP_2_0201-J68586-001,X5R,2.2UF,10V,10%,TK0,GENERIC; CDS_LOCATION: C10744
C10745 = CAP_2: CDS_PHYS_PART_NAME: CAP_2_0201-J68586-001,X5R,2.2UF,10V,10%,TK0,GENERIC; CDS_LMAN_SYM_OUTLINE: -50,50,50,-50; FP_TECH: TK0; IP: GENERIC; ROOM: NONE; OriginalSymbolOrigin: (-50,25); XY: (-1500,-300); VER: 1; ROT: 0; PHYS_PAGE: 243; LOCATION: C10745; DRAWING: @RVP1_ADL_SB_ADP_S_DDR5_SODIMM_2DPC_LIB.H55_DG2_2DPC(SCH_1):PAGE414; CDS_LIB: discrete_2; VARIANT: ?; PCB Footprint: TK0_SM0201_690X390_MC; CHIPS_PART_NAME: CAP_2; CDS_PART_NAME: CAP_2_0201-J68586-001,X5R,2.2UF,10V,10%,TK0,GENERIC; CDS_LOCATION: C10745
C10746 = CAP_2: CDS_PHYS_PART_NAME: CAP_2_0201-J68586-001,X5R,2.2UF,10V,10%,TK0,GENERIC; CDS_LMAN_SYM_OUTLINE: -50,50,50,-50; FP_TECH: TK0; IP: GENERIC; ROOM: NONE; OriginalSymbolOrigin: (-50,25); XY: (-1050,600); VER: 1; ROT: 0; PHYS_PAGE: 243; LOCATION: C10746; DRAWING: @RVP1_ADL_SB_ADP_S_DDR5_SODIMM_2DPC_LIB.H55_DG2_2DPC(SCH_1):PAGE414; CDS_LIB: discrete_2; VARIANT: ?; PCB Footprint: TK0_SM0201_690X390_MC; CHIPS_PART_NAME: CAP_2; CDS_PART_NAME: CAP_2_0201-J68586-001,X5R,2.2UF,10V,10%,TK0,GENERIC; CDS_LOCATION: C10746
C10747 = CAP_2: CDS_PHYS_PART_NAME: CAP_2_0201-J68586-001,X5R,2.2UF,10V,10%,TK0,GENERIC; CDS_LMAN_SYM_OUTLINE: -50,50,50,-50; FP_TECH: TK0; IP: GENERIC; ROOM: NONE; OriginalSymbolOrigin: (-50,25); XY: (-1050,-300); VER: 1; ROT: 0; PHYS_PAGE: 243; LOCATION: C10747; DRAWING: @RVP1_ADL_SB_ADP_S_DDR5_SODIMM_2DPC_LIB.H55_DG2_2DPC(SCH_1):PAGE414; CDS_LIB: discrete_2; VARIANT: ?; PCB Footprint: TK0_SM0201_690X390_MC; CHIPS_PART_NAME: CAP_2; CDS_PART_NAME: CAP_2_0201-J68586-001,X5R,2.2UF,10V,10%,TK0,GENERIC; CDS_LOCATION: C10747
C10748 = CAP_2: CDS_PHYS_PART_NAME: CAP_2_0201-J68586-001,X5R,2.2UF,10V,10%,TK0,GENERIC; CDS_LMAN_SYM_OUTLINE: -50,50,50,-50; FP_TECH: TK0; IP: GENERIC; ROOM: NONE; OriginalSymbolOrigin: (-50,25); XY: (-600,600); VER: 1; ROT: 0; PHYS_PAGE: 243; LOCATION: C10748; DRAWING: @RVP1_ADL_SB_ADP_S_DDR5_SODIMM_2DPC_LIB.H55_DG2_2DPC(SCH_1):PAGE414; CDS_LIB: discrete_2; VARIANT: ?; PCB Footprint: TK0_SM0201_690X390_MC; CHIPS_PART_NAME: CAP_2; CDS_PART_NAME: CAP_2_0201-J68586-001,X5R,2.2UF,10V,10%,TK0,GENERIC; CDS_LOCATION: C10748
C10749 = CAP_2: CDS_PHYS_PART_NAME: CAP_2_0201-J68586-001,X5R,2.2UF,10V,10%,TK0,GENERIC; CDS_LMAN_SYM_OUTLINE: -50,50,50,-50; FP_TECH: TK0; IP: GENERIC; ROOM: NONE; OriginalSymbolOrigin: (-50,25); XY: (-600,-300); VER: 1; ROT: 0; PHYS_PAGE: 243; LOCATION: C10749; DRAWING: @RVP1_ADL_SB_ADP_S_DDR5_SODIMM_2DPC_LIB.H55_DG2_2DPC(SCH_1):PAGE414; CDS_LIB: discrete_2; VARIANT: ?; PCB Footprint: TK0_SM0201_690X390_MC; CHIPS_PART_NAME: CAP_2; CDS_PART_NAME: CAP_2_0201-J68586-001,X5R,2.2UF,10V,10%,TK0,GENERIC; CDS_LOCATION: C10749
C10751 = CAP_2: CDS_PHYS_PART_NAME: CAP_2_0201-J68586-001,X5R,2.2UF,10V,10%,TK0,GENERIC; CDS_LMAN_SYM_OUTLINE: -50,50,50,-50; FP_TECH: TK0; IP: GENERIC; ROOM: NONE; OriginalSymbolOrigin: (-50,25); XY: (-150,-300); VER: 1; ROT: 0; PHYS_PAGE: 243; LOCATION: C10751; DRAWING: @RVP1_ADL_SB_ADP_S_DDR5_SODIMM_2DPC_LIB.H55_DG2_2DPC(SCH_1):PAGE414; CDS_LIB: discrete_2; VARIANT: ?; PCB Footprint: TK0_SM0201_690X390_MC; CHIPS_PART_NAME: CAP_2; CDS_PART_NAME: CAP_2_0201-J68586-001,X5R,2.2UF,10V,10%,TK0,GENERIC; CDS_LOCATION: C10751
C10752 = CAP_2: CDS_PHYS_PART_NAME: CAP_2_0201-J68586-001,X5R,2.2UF,10V,10%,TK0,GENERIC; CDS_LMAN_SYM_OUTLINE: -50,50,50,-50; FP_TECH: TK0; IP: GENERIC; ROOM: NONE; OriginalSymbolOrigin: (-50,25); XY: (-150,600); VER: 1; ROT: 0; PHYS_PAGE: 243; LOCATION: C10752; DRAWING: @RVP1_ADL_SB_ADP_S_DDR5_SODIMM_2DPC_LIB.H55_DG2_2DPC(SCH_1):PAGE414; CDS_LIB: discrete_2; VARIANT: ?; PCB Footprint: TK0_SM0201_690X390_MC; CHIPS_PART_NAME: CAP_2; CDS_PART_NAME: CAP_2_0201-J68586-001,X5R,2.2UF,10V,10%,TK0,GENERIC; CDS_LOCATION: C10752
C10753 = CAP_2: CDS_PHYS_PART_NAME: CAP_2_0201-J68586-001,X5R,2.2UF,10V,10%,TK0,GENERIC; CDS_LMAN_SYM_OUTLINE: -50,50,50,-50; FP_TECH: TK0; IP: GENERIC; ROOM: NONE; OriginalSymbolOrigin: (-50,25); XY: (300,-300); VER: 1; ROT: 0; PHYS_PAGE: 243; LOCATION: C10753; DRAWING: @RVP1_ADL_SB_ADP_S_DDR5_SODIMM_2DPC_LIB.H55_DG2_2DPC(SCH_1):PAGE414; CDS_LIB: discrete_2; VARIANT: ?; PCB Footprint: TK0_SM0201_690X390_MC; CHIPS_PART_NAME: CAP_2; CDS_PART_NAME: CAP_2_0201-J68586-001,X5R,2.2UF,10V,10%,TK0,GENERIC; CDS_LOCATION: C10753
C10754 = CAP_2: CDS_PHYS_PART_NAME: CAP_2_0201-J68586-001,X5R,2.2UF,10V,10%,TK0,GENERIC; CDS_LMAN_SYM_OUTLINE: -50,50,50,-50; FP_TECH: TK0; IP: GENERIC; ROOM: NONE; OriginalSymbolOrigin: (-50,25); XY: (300,600); VER: 1; ROT: 0; PHYS_PAGE: 243; LOCATION: C10754; DRAWING: @RVP1_ADL_SB_ADP_S_DDR5_SODIMM_2DPC_LIB.H55_DG2_2DPC(SCH_1):PAGE414; CDS_LIB: discrete_2; VARIANT: ?; PCB Footprint: TK0_SM0201_690X390_MC; CHIPS_PART_NAME: CAP_2; CDS_PART_NAME: CAP_2_0201-J68586-001,X5R,2.2UF,10V,10%,TK0,GENERIC; CDS_LOCATION: C10754
C10755 = CAP_2: CDS_PHYS_PART_NAME: CAP_2_0201-J68586-001,X5R,2.2UF,10V,10%,TK0,GENERIC; CDS_LMAN_SYM_OUTLINE: -50,50,50,-50; FP_TECH: TK0; IP: GENERIC; ROOM: NONE; OriginalSymbolOrigin: (-50,25); XY: (750,-300); VER: 1; ROT: 0; PHYS_PAGE: 243; LOCATION: C10755; DRAWING: @RVP1_ADL_SB_ADP_S_DDR5_SODIMM_2DPC_LIB.H55_DG2_2DPC(SCH_1):PAGE414; CDS_LIB: discrete_2; VARIANT: ?; PCB Footprint: TK0_SM0201_690X390_MC; CHIPS_PART_NAME: CAP_2; CDS_PART_NAME: CAP_2_0201-J68586-001,X5R,2.2UF,10V,10%,TK0,GENERIC; CDS_LOCATION: C10755
C10756 = CAP_2: CDS_PHYS_PART_NAME: CAP_2_0201-J68586-001,X5R,2.2UF,10V,10%,TK0,GENERIC; CDS_LMAN_SYM_OUTLINE: -50,50,50,-50; FP_TECH: TK0; IP: GENERIC; ROOM: NONE; OriginalSymbolOrigin: (-50,25); XY: (750,600); VER: 1; ROT: 0; PHYS_PAGE: 243; LOCATION: C10756; DRAWING: @RVP1_ADL_SB_ADP_S_DDR5_SODIMM_2DPC_LIB.H55_DG2_2DPC(SCH_1):PAGE414; CDS_LIB: discrete_2; VARIANT: ?; PCB Footprint: TK0_SM0201_690X390_MC; CHIPS_PART_NAME: CAP_2; CDS_PART_NAME: CAP_2_0201-J68586-001,X5R,2.2UF,10V,10%,TK0,GENERIC; CDS_LOCATION: C10756
C10757 = CAP_2: CDS_PHYS_PART_NAME: CAP_2_0201-J68586-001,X5R,2.2UF,10V,10%,TK0,GENERIC; CDS_LMAN_SYM_OUTLINE: -50,50,50,-50; FP_TECH: TK0; IP: GENERIC; ROOM: NONE; OriginalSymbolOrigin: (-50,25); XY: (1200,-300); VER: 1; ROT: 0; PHYS_PAGE: 243; LOCATION: C10757; DRAWING: @RVP1_ADL_SB_ADP_S_DDR5_SODIMM_2DPC_LIB.H55_DG2_2DPC(SCH_1):PAGE414; CDS_LIB: discrete_2; VARIANT: ?; PCB Footprint: TK0_SM0201_690X390_MC; CHIPS_PART_NAME: CAP_2; CDS_PART_NAME: CAP_2_0201-J68586-001,X5R,2.2UF,10V,10%,TK0,GENERIC; CDS_LOCATION: C10757